# EAGLE design genFunz_header (EAGLE 4.16)
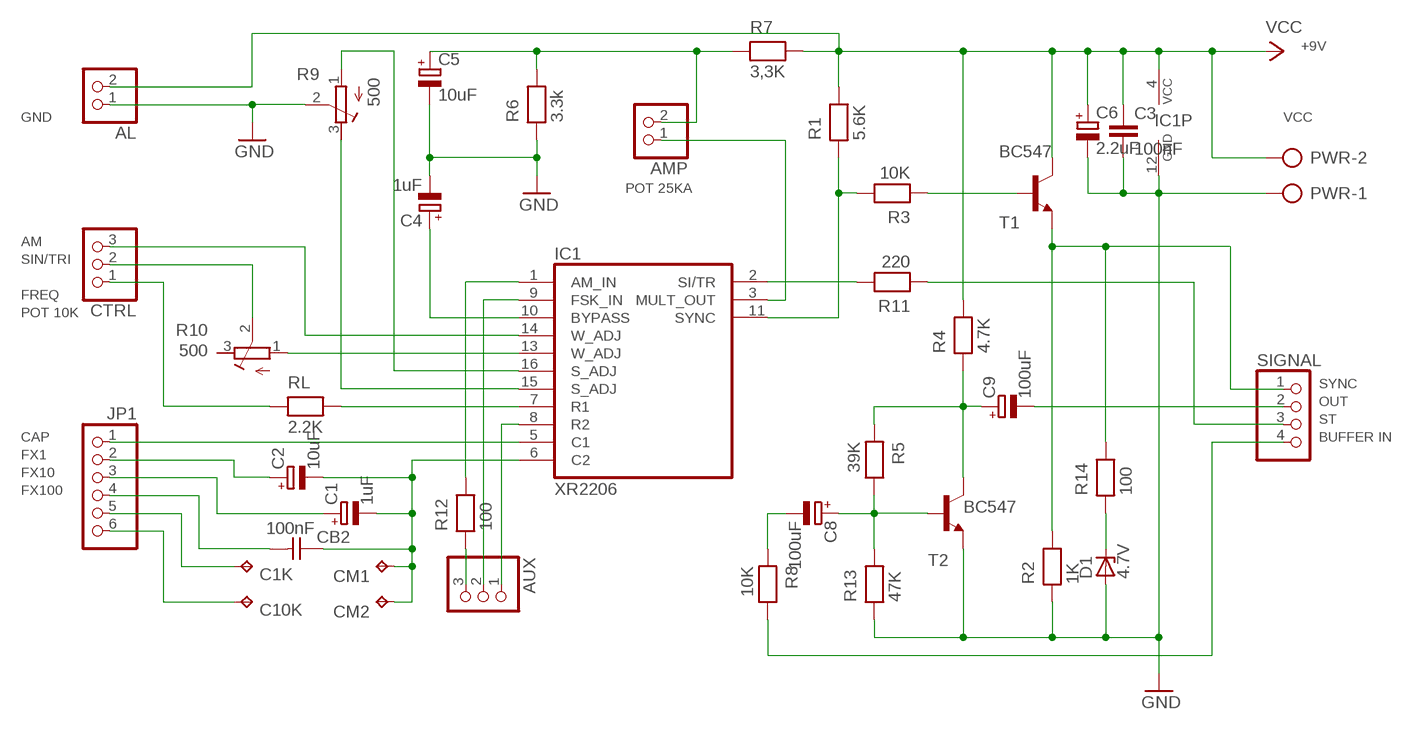
[diagram p0: schematic, sheet 1]

## Parts
AL  PINHD-1X2  [1X02]
AMP  PINHD-1X2  [1X02]
AUX  PINHD-1X3  [1X03]
C1  1uF  CPOL-EUE5-4  [E5-4]
C1K  TPPAD1-13  [P1-13]
C2  10uF  CPOL-EUE5-4  [E5-4]
C3  100nF  C-EU050-024X044  [C050-024X044]
C4  1uF  CPOL-EUE5-4  [E5-4]
C5  10uF  CPOL-EUE5-4  [E5-4]
C6  2.2uF  CPOL-EUE5-4  [E5-4]
C8  100uF  CPOL-EUE5-4  [E5-4]
C9  100uF  CPOL-EUE5-4  [E5-4]
C10K  TPPAD1-13  [P1-13]
CB2  100nF  CAPNP-2,5  [C-2,5]
CM1  TPPAD1-13  [P1-13]
CM2  TPPAD1-13  [P1-13]
CTRL  PINHD-1X3  [1X03]
D1  4.7V  ZENER-DIODEZD-7.5  [ZDIO-7.5]
IC1  XR2206  XR-2206  [DIL16]
JP1  PINHD-1X6  [1X06]
PWR  AK300/2  [AK300/2]
R1  5.6K  RESEU-5  [R-5]
R2  1K  RESEU-5  [R-5]
R3  10K  RESEU-5  [R-5]
R4  4.7K  RESEU-5  [R-5]
R5  39K  RESEU-5  [R-5]
R6  3.3k  RESEU-5  [R-5]
R7  3,3K  RESEU-5  [R-5]
R8  10K  RESEU-5  [R-5]
R9  500  R-TRIMM64W  [RTRIM64W]
R10  500  R-TRIMM64W  [RTRIM64W]
R11  220  RESEU-5  [R-5]
R12  100  RESEU-5  [R-5]
R13  47K  RESEU-5  [R-5]
R14  100  RESEU-5  [R-5]
RL  2.2K  RESEU-5  [R-5]
SIGNAL  PINHD-1X4  [1X04]
T1  BC547  [TO92]
T2  BC547  [TO92]

## Nets
GND [pwr]: AL.1 C3.2 C4.- C5.- C6.- D1.A IC1.12(GND) PWR.1 R2.1 R6.1 R9.2(S) R13.1 T2.1(E)
N$1: IC1.15(S_ADJ) R9.3(A)
N$2: IC1.16(S_ADJ) R9.1(E)
N$3: IC1.13(W_ADJ) R10.1(E)
N$4: AMP.2 C5.+ R6.2 R7.1
N$5: C8.- R8.1
N$6: IC1.11(SYNC) R1.1 R3.2
N$7: AMP.1 IC1.3(MULT_OUT)
N$8: IC1.7(R1) RL.2
N$9: C1.- C2.- CB2.1 CM1.1(TP) CM2.1(TP) IC1.6(C2)
N$10: C4.+ IC1.10(BYPASS)
N$11: C8.+ R5.2 R13.2 T2.2(B)
N$12: R3.1 T1.2(B)
N$13: C9.- SIGNAL.2
N$14: C1K.1(TP) JP1.5
N$15: CTRL.2 R10.2(S)
N$16: CTRL.3 IC1.14(W_ADJ)
N$17: IC1.2(SI/TR) R11.2
N$18: CTRL.1 RL.1
N$19: C1.+ JP1.3
N$20: R11.1 SIGNAL.3
N$21: AUX.3 R12.1
N$22: AUX.1 IC1.8(R2)
N$23: AUX.2 IC1.9(FSK_IN)
N$24: IC1.1(AM_IN) R12.2
N$25: CB2.2 JP1.4
N$26: C2.+ JP1.2
N$27: R8.2 SIGNAL.4
N$33: C10K.1(TP) JP1.6
N$34: D1.C R14.1
N$35: IC1.5(C1) JP1.1
N$274: R2.2 R14.2 SIGNAL.1 T1.1(E)
N$275: C9.+ R4.1 R5.1 T2.3(C)
VCC [pwr]: AL.2 C3.1 C6.+ IC1.4(VCC) PWR.2 R1.2 R4.2 R7.2 T1.3(C)
Unconnected: R10.3(A)

## Notes on the sheet
- +9V
- GND | VCC
- POT 25KA
- AM
- SIN/TRI
- FREQ
- POT 10K
- SYNC
- OUT
- ST
- CAP | BUFFER IN
- FX1
- FX10
- FX100

## Library data of the parts
AL AMP = pinhead:PINHD-1X2: PIN HEADER
AUX CTRL = pinhead:PINHD-1X3: PIN HEADER
C1 C2 C4-C6 C8 C9 = rcl:CPOL-EU: POLARIZED CAPACITOR, European symbol
C1K C10K CM1 CM2 = testpad:TP
C3 = rcl:C-EU: CAPACITOR, European symbol
CB2 = discrete:CAPNP-2,5
D1 = diode:ZENER-DIODE: Z-Diode
IC1 = exar:XR-2206: Monolithic FUNCTION GENERATOR
JP1 = pinhead:PINHD-1X6: PIN HEADER
PWR = con-ptr500:AK300/2: CONNECTOR
R1-R8 R11-R14 RL = discrete:RESEU-5
R9 R10 = rcl:R-TRIMM: Trimm resistor
SIGNAL = pinhead:PINHD-1X4: PIN HEADER
T1 T2 = transistor:BC547: NPN TRANSISTOR

## Net classes
0 default: width 0.305 mm
1 pwr: width 0.508 mm

## Board
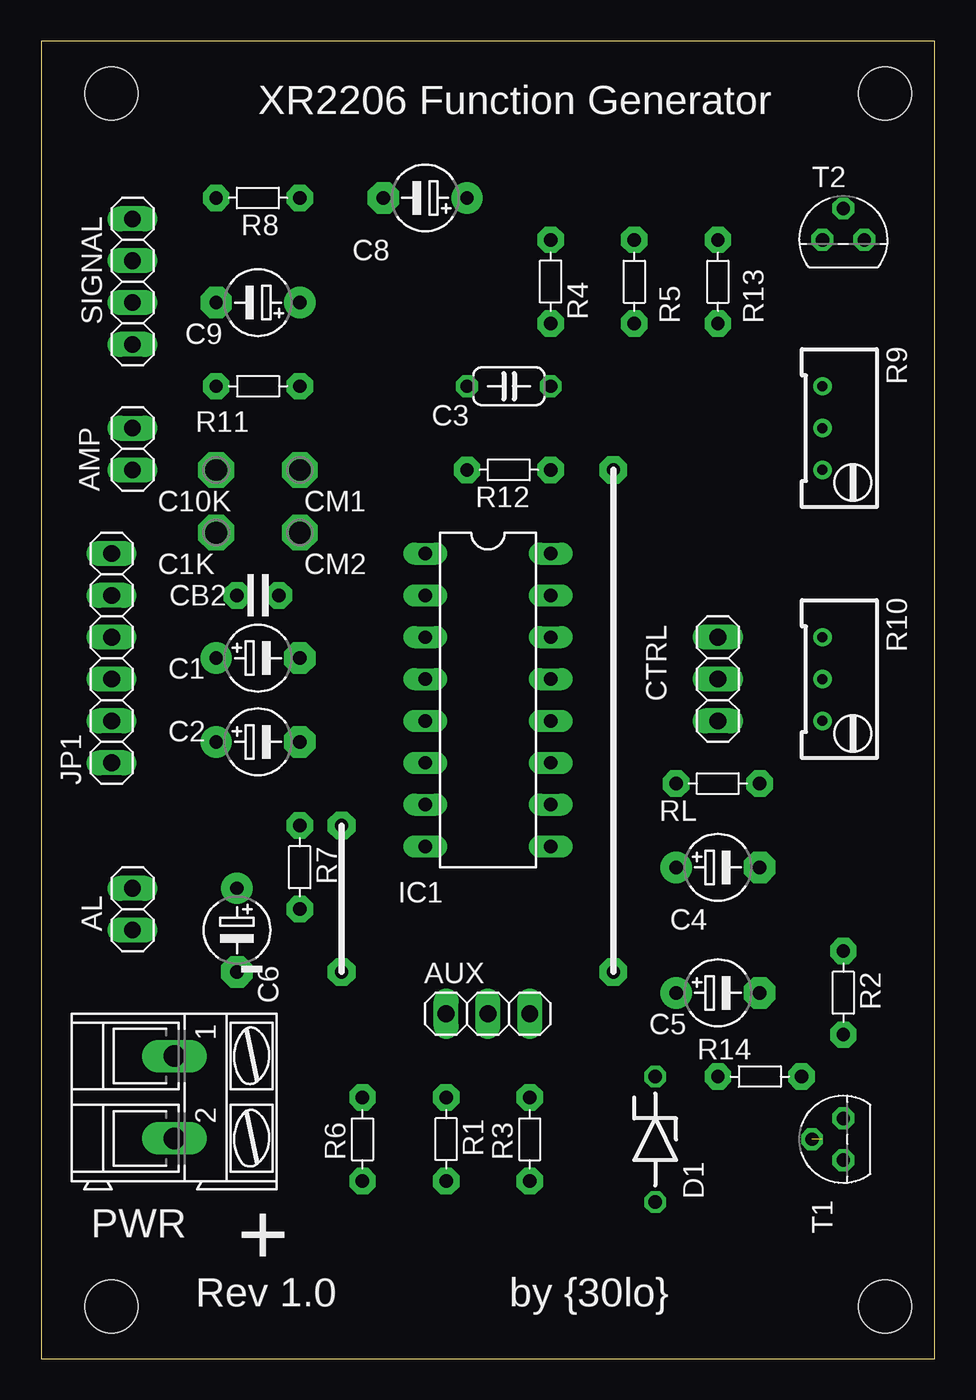
[diagram p1: board, top side]
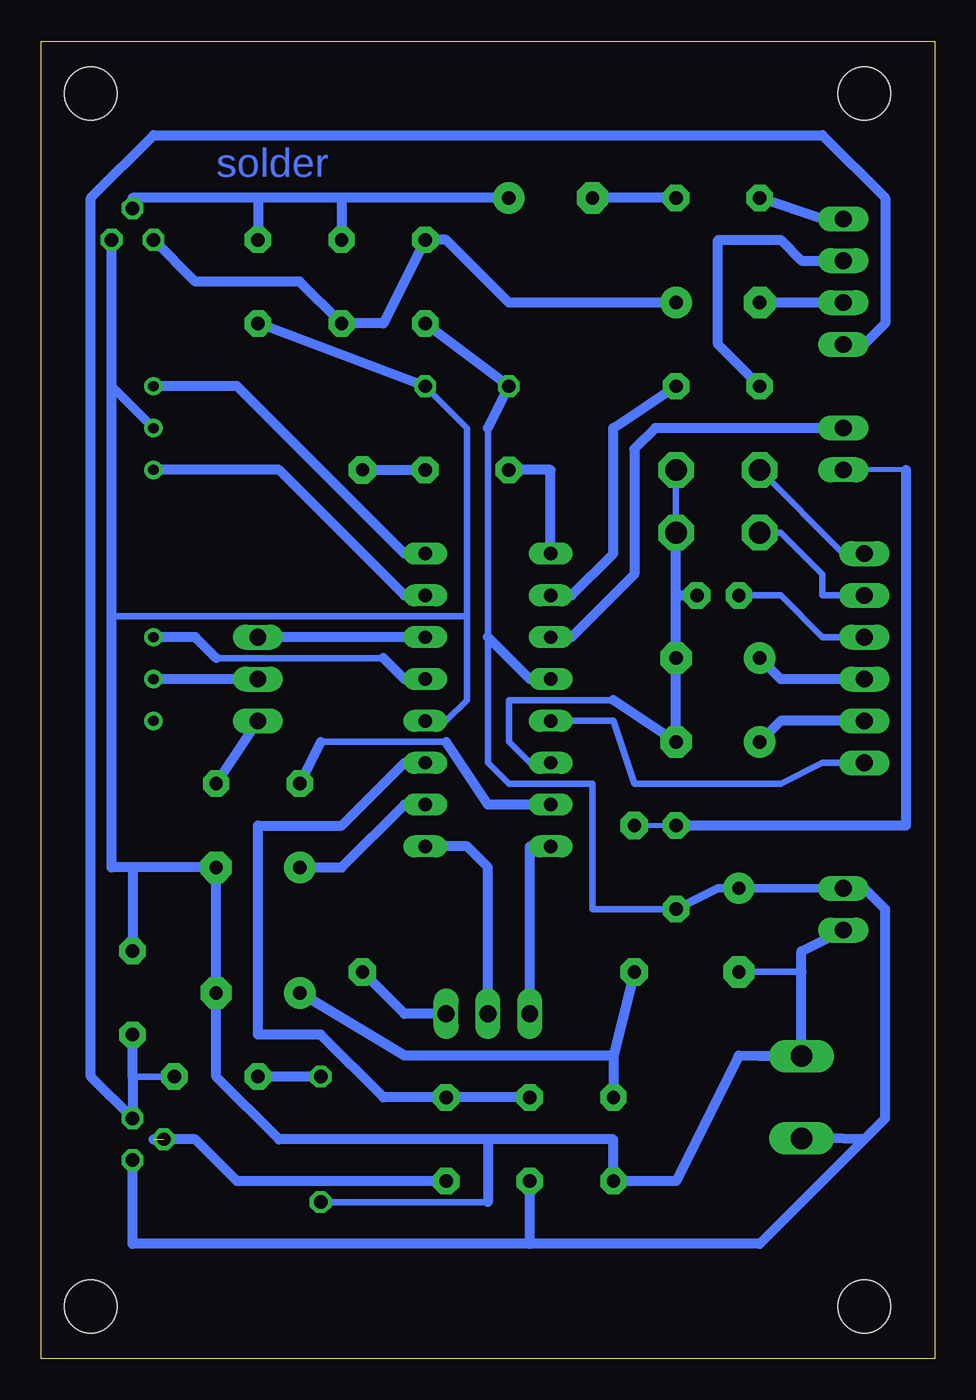
[diagram p2: board, bottom side, seen from below]

Size 54.28 x 80 mm. Coordinates in mm from the lower left corner, seen from the top.
Outline: 0,0 54.28,0 54.28,80 0,80 0,0
Copper layers (1*16): Top 0.035mm / dielectric 1.5mm / Bottom 0.035mm
Design rules "default": minimum track width 10mil, minimum drill 24mil, track to track 8mil, track to pad 8mil, pad to pad 8mil, via to via 8mil, smd to smd 8mil, copper to edge 40mil, drill to drill 8mil, minimum pad ring 10mil, minimum via ring 8mil, stop-mask expansion 4mil, vias tented up to drill 0mil, thermal gap 10mil
Holes 3.2 mm at 4.28,76.83 4.28,3.17 51.27,76.83 51.27,3.17

### Footprints (pad centres in the part's own frame; a part is rotated, then mirrored left to right if it is on the bottom)
1X02 = drill 1.016 long: 1 -1.27,0; 2 1.27,0
1X03 = drill 1.016 long: 1 -2.54,0; 2 0,0; 3 2.54,0
E5-4 = drill 0.813 pad 1.905: + -2.54,0 | drill 0.813 pad 1.905 octagon: - 2.54,0
P1-13 = drill 1.321 pad 2.159 octagon: 1 0,0
C050-024X044 = drill 0.813 octagon: 1 -2.54,0; 2 2.54,0
C-2,5 = drill 0.813 pad 1.6 octagon: 1 -1.27,0; 2 1.27,0
ZDIO-7.5 = drill 0.813 octagon: A 3.81,0; C -3.81,0
DIL16 = drill 0.813 long: 1 -8.89,-3.81; 2 -6.35,-3.81; 3 -3.81,-3.81; 4 -1.27,-3.81; 5 1.27,-3.81; 6 3.81,-3.81; 7 6.35,-3.81; 8 8.89,-3.81; 9 8.89,3.81; 10 6.35,3.81; 11 3.81,3.81; 12 1.27,3.81; 13 -1.27,3.81; 14 -3.81,3.81; 15 -6.35,3.81; 16 -8.89,3.81
1X06 = drill 1.016 long: 1 -6.35,0; 2 -3.81,0; 3 -1.27,0; 4 1.27,0; 5 3.81,0; 6 6.35,0
AK300/2 = drill 1.321 long: 1 -2.515,0; 2 2.489,0
R-5 = drill 0.813 pad 1.6 octagon: 1 -2.54,0; 2 2.54,0
RTRIM64W = drill 0.61: 1 1.27,-2.54; 2 1.27,0; 3 1.27,2.54
1X04 = drill 1.016 long: 1 -3.81,0; 2 -1.27,0; 3 1.27,0; 4 3.81,0
TO92 = drill 0.813 octagon: 1 1.27,0; 2 0,1.905; 3 -1.27,0

### Placement (x,y rotation side)
AL  5.55,27.3 90 top
AMP  5.55,55.24 270 top
AUX  27.14,20.95 0 top
C1  13.17,42.54 0 top
C1K  10.63,50.16 0 top
C2  13.17,37.46 0 top
C3  28.41,59.05 0 top
C4  41.11,29.84 0 top
C5  41.11,22.22 0 top
C6  11.9,26.03 270 top
C8  23.33,70.48 180 top
C9  13.17,64.13 180 top
C10K  10.63,53.97 0 top
CB2  13.17,46.35 180 top
CM1  15.71,53.97 0 top
CM2  15.71,50.16 0 top
CTRL  41.11,41.27 90 top
D1  37.3,13.33 270 top
IC1  27.14,40 270 top
JP1  4.28,42.54 90 top
PWR  8.09,15.87 270 top
R1  24.6,13.33 270 top
R2  48.73,22.22 270 top
R3  29.68,13.33 90 top
R4  30.95,65.4 270 top
R5  36.03,65.4 90 top
R6  19.52,13.33 90 top
R7  15.71,29.84 270 top
R8  13.17,70.48 180 top
R9  48.73,56.51 180 top
R10  48.73,41.27 180 top
R11  13.17,59.05 0 top
R12  28.41,53.97 180 top
R13  41.11,65.4 90 top
R14  43.65,17.14 0 top
RL  41.11,34.92 180 top
SIGNAL  5.55,65.4 90 top
T1  48.73,13.33 90 top
T2  48.73,67.94 0 top

### Tracks (layer width: path | path; a pad name or v marks a point on that pad's centre or on a via)
GND
  Bottom 0.406: 28.41,45.08 28.41,55.24 28.41,56.51 C3.2 | 28.41,45.08 28.41,40 29.68,38.73 IC1.12 | 50,45.08 28.41,45.08 | 8.09,23.49 C6.- | 27.14,9.52 D1.A
  Bottom 0.508: 50,59.05 R9.2
  Bottom 0.61: T2.1 50,59.05 50,45.08 50,29.84 48.73,29.84 | 27.14,13.33 19.52,13.33 R6.1 15.71,10.79 11.9,18.41 10.63,18.38 PWR.1 8.09,23.49 8.09,24.76 AL.1 | 27.14,13.33 39.84,13.33 43.65,17.14 C5.- C4.- 48.73,29.84 | C3.2 R13.1 | 48.73,29.84 R2.1 | 27.14,13.33 27.14,9.52
N$1
  Bottom 0.305: IC1.15 32.22,46.35
  Bottom 0.61: R9.3 39.84,53.97 32.22,46.35
N$2
  Bottom 0.305: IC1.16 32.22,48.89
  Bottom 0.61: R9.1 42.38,59.05 32.22,48.89
N$3
  Bottom 0.305: IC1.13 32.22,41.27
  Bottom 0.406: 33.49,42.54 43.65,42.54
  Bottom 0.61: R10.1 44.92,43.81 43.65,42.54 | 32.22,41.27 33.49,42.54
N$4  (via drill 0.8 pad 1.68)
  Top 0.305: v18.25,32.38 v18.25,23.49
  Bottom 0.305: 1.74,53.97 AMP.2 | R7.1 v18.25,32.38
  Bottom 0.61: 19.52,18.41 32.22,18.41 C5.+ | 19.52,18.41 R6.2 | 1.74,53.97 1.74,32.38 R7.1 | v18.25,23.49 19.52,18.41
N$5
  Bottom 0.61: R8.1 C8.-
N$6
  Bottom 0.305: 32.22,36.19 IC1.11
  Bottom 0.61: 32.22,36.19 36.03,32.38 41.11,32.38 41.11,19.68 37.3,19.68 33.49,15.87 R3.2 R1.1
N$7
  Bottom 0.305: 22.06,43.81 IC1.3
  Bottom 0.61: 22.06,43.81 18.25,47.62 18.25,55.24 16.98,56.51 AMP.1
N$8
  Bottom 0.406: 29.68,37.46 37.3,37.46
  Bottom 0.61: IC1.7 27.14,33.65 29.68,37.46 | 37.3,37.46 RL.2
N$9
  Bottom 0.305: 24.6,36.19 IC1.6
  Bottom 0.406: 19.52,40 25.87,40 25.87,37.46 24.6,36.19 | CM2.1 CM1.1
  Bottom 0.61: 19.52,40 C2.- C1.- 15.71,46.35 | 15.71,46.35 CB2.1 | 15.71,46.35 CM2.1
N$10
  Bottom 0.61: C4.+ 36.03,29.84 32.22,33.65 IC1.10
N$11
  Bottom 0.305: 48.73,70.48 T2.2
  Bottom 0.61: 36.03,70.48 R5.2 | 36.03,70.48 41.11,70.48 | 41.11,70.48 48.73,70.48 | 41.11,70.48 R13.2 | C8.+ 36.03,70.48
N$12  (1 unrouted)
  Bottom 0.61: R3.1 42.38,10.79 44.92,13.33 47.46,13.33
N$13
  Bottom 0.61: SIGNAL.2 C9.-
N$14
  Bottom 0.406: JP1.5 6.82,46.35 6.82,47.62 9.36,50.16 C1K.1
N$15
  Bottom 0.61: CTRL.2 R10.2
N$16
  Bottom 0.61: IC1.14 CTRL.3
N$17
  Bottom 0.305: 22.06,46.35 IC1.2
  Bottom 0.61: 22.06,46.35 19.52,48.89 19.52,56.51 R11.2
N$18
  Bottom 0.61: RL.1 CTRL.1
N$19
  Bottom 0.61: JP1.3 9.36,41.27 C1.+
N$20
  Bottom 0.61: R11.1 13.17,61.59 13.17,67.94 9.36,67.94 8.09,66.67 SIGNAL.3
N$21  (via drill 0.8 pad 1.68)
  Top 0.305: v34.76,23.49 v34.76,53.97
  Bottom 0.61: v34.76,53.97 R12.1 | AUX.3 32.22,20.95 v34.76,23.49
N$22
  Bottom 0.305: 24.6,31.11 IC1.8
  Bottom 0.61: AUX.1 24.6,31.11
N$23
  Bottom 0.61: IC1.9 28.41,31.11 27.14,29.84 AUX.2
N$24
  Bottom 0.61: R12.2 23.33,53.97 IC1.1
N$25
  Bottom 0.406: JP1.4 6.82,43.81 9.36,46.35 CB2.2
N$26
  Bottom 0.61: JP1.2 9.36,38.73 C2.+
N$27
  Bottom 0.305: SIGNAL.4 6.82,69.21
  Bottom 0.61: 6.82,69.21 R8.2
N$32  (via drill 0.8 pad 1.68)
  other vias: 34.76,53.97
N$33
  Bottom 0.406: JP1.6 5.55,48.89 C10K.1
N$34
  Bottom 0.61: D1.C R14.1
N$35
  Bottom 0.406: JP1.1 6.82,36.19 9.36,34.92 18.25,34.92 19.52,38.73 IC1.5
N$274
  Bottom 0.305: 4.28,61.59 SIGNAL.1
  Bottom 0.406: R14.2 48.73,17.14
  Bottom 0.61: R2.2 48.73,17.14 T1.1 51.27,17.14 51.27,70.48 47.46,74.29 6.82,74.29 3.01,70.48 3.01,62.86 4.28,61.59
N$275
  Bottom 0.61: C9.+ 25.87,64.13 29.68,67.94 R4.1 33.49,62.86 R5.1 38.57,65.4 44.92,65.4 T2.3
VCC
  Bottom 0.406: 27.14,56.51 27.14,43.81 27.14,36.19 25.87,34.92 20.79,34.92 20.79,27.3 R7.2
  Bottom 0.508: R7.2 13.17,28.57 C6.+ AL.2 4.28,28.57 | 24.6,41.27 IC1.4
  Bottom 0.61: 27.14,43.81 24.6,41.27 | T1.3 48.73,6.98 24.6,6.98 | 24.6,6.98 10.63,6.98 4.28,13.33 | 4.28,13.33 3.01,14.6 3.01,27.3 4.28,28.57 | 27.14,56.51 C3.1 R4.2 | 24.6,6.98 R1.2 | PWR.2 6.82,13.38 4.28,13.33

### Text on the board
Bottom: solder
tNames: XR2206 Function Generator | - | + | Rev 1.0 | by {30lo}